# EAGLE design target (EAGLE 7.0.0)
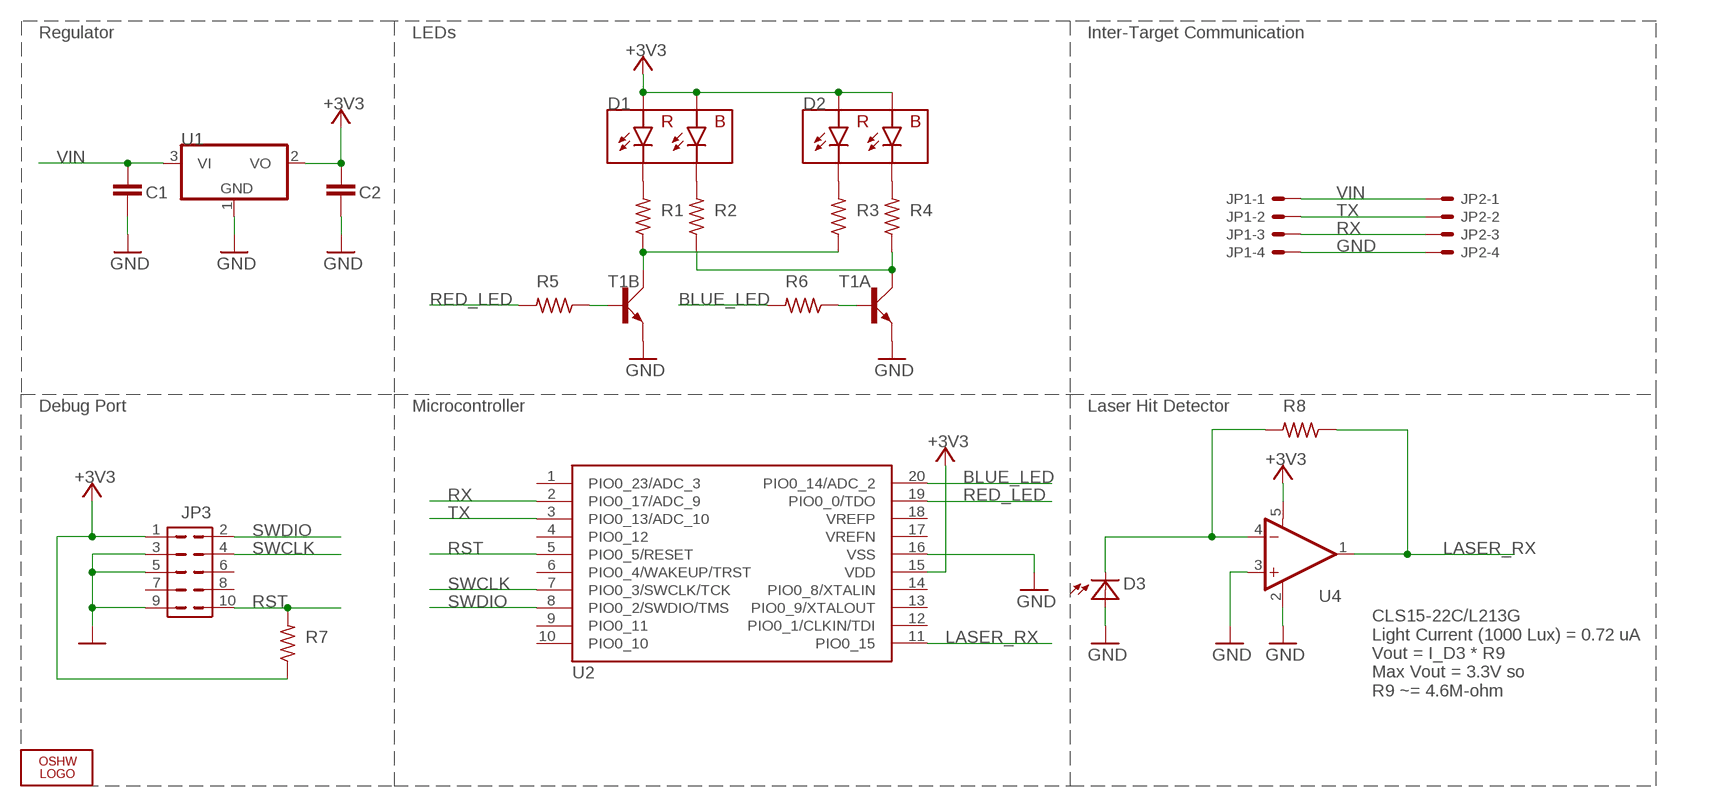
[diagram p0: schematic, sheet 1]

## Parts
C1  C1608X5R1C106M080AB  CAP0603-CAP  [0603-CAP]
C2  C1608X5R1C106M080AB  CAP0603-CAP  [0603-CAP]
D1  150141RB73100  LED_RB  [150141RB]
D2  150141RB73100  LED_RB  [150141RB]
D3  638-CLS1522CL213GTR8  CLS15CLS15  [CLS15]
JP1  798-DF134P125V20  53398-04  [53398-04]
JP2  798-DF134P125V20  53398-04  [53398-04]
JP3  FTSH-105-01-L  FTSH-105  [FTSH-105-01-XXX-DV-K]
LOGO2  OSHW_LOGO_FILLX0150-NT  [OSHW_FILLX150_NOTEXT]
R1  71-CRCW060368R0FKEB  R-US_R0603  [R0603]
R2  71-CRCW0603-5.6-E3  R-US_R0603  [R0603]
R3  71-CRCW060368R0FKEB  R-US_R0603  [R0603]
R4  71-CRCW0603-5.6-E3  R-US_R0603  [R0603]
R5  71-CRCW0603220RFKEB  R-US_R0603  [R0603]
R6  71-CRCW0603220RFKEB  R-US_R0603  [R0603]
R7  71-CRCW0603-10K-E3  R-US_R0603  [R0603]
R8  71-CRCW06034M64FKEA  R-US_R0603  [R0603]
T1  771-BC847BS-T/R  BC847BS  [SOT363_PHILIPS]
U1  579-MCP1703T-3002ECB  MCP1703CB  [SOT23]
U2  771-LPC824M201JDH20J  LPC824  [TSSOP20]
U4  579-MCP6291T-E/OT  MCP6291T-E/OT  [SOT23-5]

## Nets
+3V3: C2.1 D1.1 D1.2 D2.1 D2.2 JP3.1 R7.1 U1.2(VO) U2.15(VDD) U4.5(V+)
BLUE_LED: R6.2 U2.20(PIO0_14/ADC_2)
GND: C1.2 C2.2 D3.1(A) D3.2(A) JP1.4 JP2.4 JP3.3 JP3.5 JP3.9 T1.1(A:E) T1.4(B:E) U1.1(GND) U2.16(VSS) U4.2(V-) U4.3(+IN)
LASER_RX: R8.1 U2.11(PIO0_15) U4.1(OUT)
N$1: R2.1 R4.1 T1.6(A:C)
N$2: R1.1 R3.1 T1.3(B:C)
N$3: D1.3 R1.2
N$4: R6.1 T1.2(A:B)
N$5: D3.3(C) D3.4(C) R8.2 U4.4(-IN)
N$6: D2.3 R3.2
N$7: D1.4 R2.2
N$8: D2.4 R4.2
N$11: R5.1 T1.5(B:B)
RED_LED: R5.2 U2.19(PIO0_0/TDO)
RST: JP3.10 R7.2 U2.5(PIO0_5/RESET)
RX: JP1.3 JP2.3 U2.2(PIO0_17/ADC_9)
SWCLK: JP3.4 U2.7(PIO0_3/SWCLK/TCK)
SWDIO: JP3.2 U2.8(PIO0_2/SWDIO/TMS)
TX: JP1.2 JP2.2 U2.3(PIO0_13/ADC_10)
VIN: C1.1 JP1.1 JP2.1 U1.3(VI)
Unconnected: JP3.6 JP3.7 JP3.8 U2.1(PIO0_23/ADC_3) U2.4(PIO0_12) U2.6(PIO0_4/WAKEUP/TRST) U2.9(PIO0_11) U2.10(PIO0_10) U2.12(PIO0_1/CLKIN/TDI) U2.13(PIO0_9/XTALOUT) U2.14(PIO0_8/XTALIN) U2.17(VREFN) U2.18(VREFP)

## Notes on the sheet
- Regulator | LEDs | Inter-Target Communication
- Debug Port | Microcontroller | Laser Hit Detector
- CLS15-22C/L213G
  Light Current (1000 Lux) = 0.72 uA
  Vout = I_D3 * R9
  Max Vout = 3.3V so
  R9 ~= 4.6M-ohm

## Library data of the parts
C1 C2 = SparkFun-Passives:CAP: Capacitor Standard 0603 ceramic capacitor, and 0.1" leaded capacitor.
D1 D2 = torpedo:LED_RB
D3 = torpedo:CLS15
JP1 JP2 = con-molex:53?-04: CONNECTOR wire to board 1.25 mm (.049 inch) pitch header; OC_FARNELL: 1125367; OC_NEWARK: unknown
JP3 = torpedo:FTSH-105
LOGO2 = ohw-logo:OSHW_LOGO_FILL
R1-R8 = rcl:R-US_: RESISTOR, American symbol
T1 = transistor-small-signal:BC847BS: NPN general purpose double transistor Source: http://www.farnell.com/datasheets/2466.pdf
U1 = linear:MCP1703: 250 mA, 16V, Low Quiescent Current LDO Regulator Source: http://ww1.microchip.com/downloads/en/DeviceDoc/22049b.pdf
U2 = torpedo:LPC824
U4 = SparkFun-AnalogIC:MCP6291: Rail to rail OpAmp with 10MHz GBP; PROD_ID: IC-11991

## Board
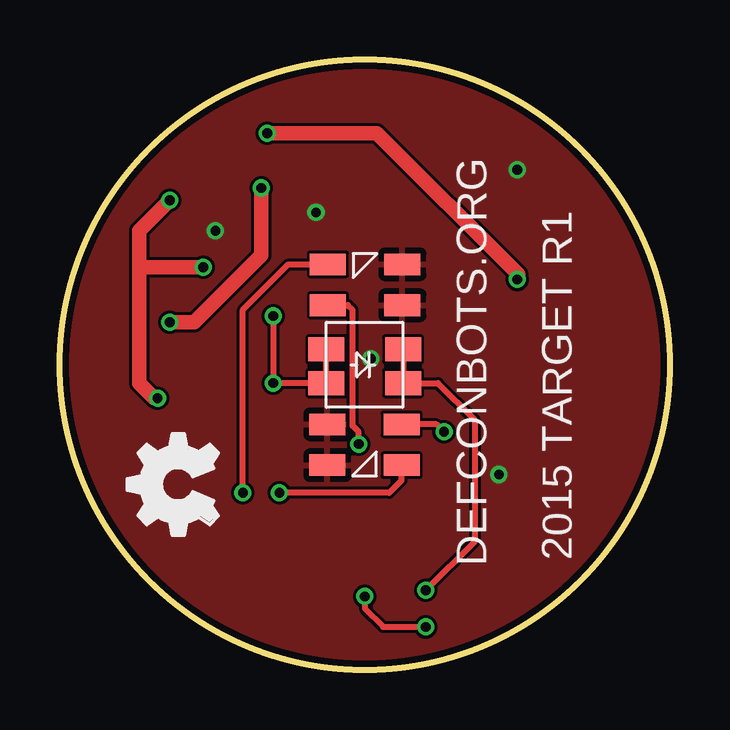
[diagram p1: board, top side]
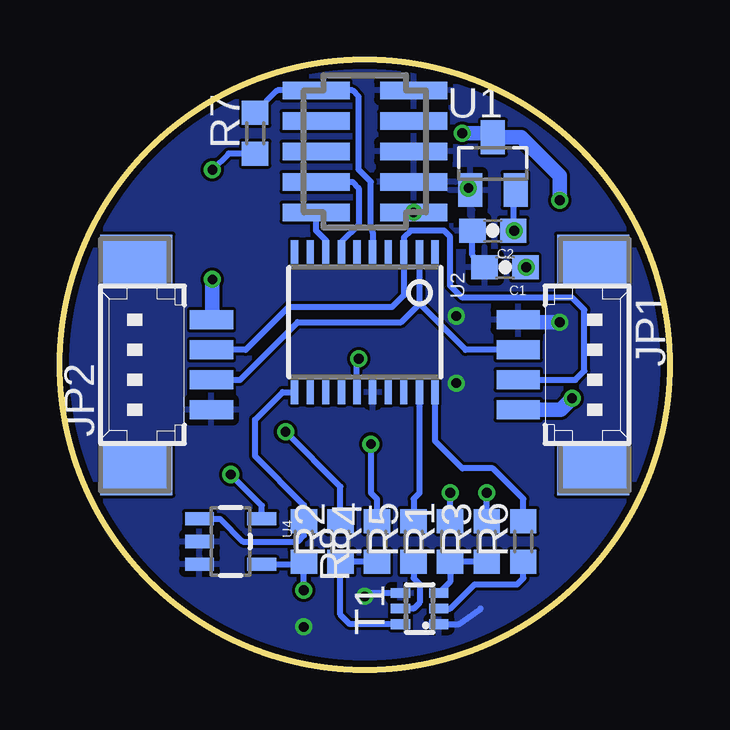
[diagram p2: board, bottom side, seen from below]

Size 25.4 x 25.4 mm. Coordinates in mm from the lower left corner, seen from the top.
Outline: circle at 12.7,12.7 radius 12.7
Copper layers (1*16): Top 0.035mm / dielectric 1.5mm / Bottom 0.035mm
Design rules "dirt_cheap_dirty_boards.v1": minimum track width 5mil, minimum drill 12mil, track to track 5mil, track to pad 5mil, pad to pad 5mil, via to via 5mil, smd to smd 0mil, copper to edge 10mil, drill to drill 10mil, minimum pad ring 10mil, minimum via ring 6mil, stop-mask expansion 2mil, vias tented up to drill 25mil, thermal gap 10mil

### Footprints (pad centres in the part's own frame; a part is rotated, then mirrored left to right if it is on the bottom)
0603-CAP = smd 1.1 x 1: 1 -0.85,0; 2 0.85,0
150141RB = smd 1.5 x 0.9: 1 3.85,2.15; 2 3.85,0.45; 3 0.75,2.15; 4 0.75,0.45
CLS15 = smd 1.5 x 1: 1 0,0; 2 0,1.4; 3 3.2,1.4; 4 3.2,0
53398-04 = smd 0.8 x 1.8: 1 1.875,-2.5; 2 0.625,-2.5; 3 -0.625,-2.5; 4 -1.875,-2.5 | smd 2.1 x 3: S1 4.375,0.625; S2 -4.375,0.625
FTSH-105-01-XXX-DV-K = smd 0.737 x 2.794: 1 -2.54,-2.032; 2 -2.54,2.032; 3 -1.27,-2.032; 4 -1.27,2.032; 5 0,-2.032; 6 0,2.032; 7 1.27,-2.032; 8 1.27,2.032; 9 2.54,-2.032; 10 2.54,2.032
R0603 = smd 1 x 1.1: 1 -0.85,0; 2 0.85,0
SOT363_PHILIPS = smd 0.4 x 0.8: 1 -0.65,-0.8; 2 0,-0.8; 3 0.65,-0.8; 4 0.65,0.8; 5 0,0.8; 6 -0.65,0.8
SOT23 = smd 1 x 1.4: 1 -0.95,-1.1; 2 0.95,-1.1; 3 0,1.1
TSSOP20 = smd 0.305 x 0.991: 1 -2.925,-2.918; 2 -2.275,-2.918; 3 -1.625,-2.918; 4 -0.975,-2.918; 5 -0.325,-2.918; 6 0.325,-2.918; 7 0.975,-2.918; 8 1.625,-2.918; 9 2.275,-2.918; 10 2.925,-2.918; 11 2.925,2.918; 12 2.275,2.918; 13 1.625,2.918; 14 0.975,2.918; 15 0.325,2.918; 16 -0.325,2.918; 17 -0.975,2.918; 18 -1.625,2.918; 19 -2.275,2.918; 20 -2.925,2.918
SOT23-5 = smd 0.55 x 1.2: 1 -0.95,-1.3; 2 0,-1.3; 3 0.95,-1.3; 4 0.95,1.3; 5 -0.95,1.3

### Placement (x,y rotation side)
C1  6.86,16.76 180 bottom
C2  7.37,18.29 180 bottom
D1  14.99,10.67 180 top
D2  10.41,14.73 0 top
D3  11.1,11.94 0 top
JP1  3.81,12.7 270 bottom
JP2  21.59,12.7 90 bottom
JP3  12.7,21.59 90 bottom
LOGO2  6.6,5.59 90 top
R1  9.14,5.33 90 bottom
R2  13.72,5.33 90 bottom
R3  7.62,5.33 90 bottom
R4  12.19,5.33 90 bottom
R5  10.67,5.33 90 bottom
R6  6.1,5.33 90 bottom
R7  17.27,22.35 90 bottom
R8  15.24,5.33 270 bottom
T1  10.41,2.54 90 bottom
U1  7.37,21.08 0 bottom
U2  12.7,14.48 180 bottom
U4  18.29,5.33 270 bottom

### Tracks (layer width: path | path; a pad name or v marks a point on that pad's centre or on a via)
+3V3  (via drill 0.41)
  Bottom 0.254: U1.2 6.52,19.88 C2.1 arc-180 v6.48,18.29 | R7.1 18.38,21.5 v19.05,20.83 | U2.15 13.03,12.88 v12.95,12.95 | U4.5 16.99,6.83 v18.29,8.13
  other vias: 10.67,19.05
  pour Top: 0,0 0,25.4 25.4,25.4 25.4,0
BLUE_LED
  Bottom 0.254: U2.20 9.78,9.52 8.64,8.38 7.37,8.38 6.1,7.11 R6.2
GND  (via drill 0.41)
  Top 0.254: D3.2 D3.1 v8.89,11.94 v8.89,14.73 | v12.7,3.05 12.7,2.54 13.46,1.78 v15.24,1.78
  Top 0.61: v8.38,20.07 8.38,17.27 5.59,14.48 v4.57,14.48
  Bottom 0.254: U1.1 8.22,19.88 | T1.1 8.78,1.89 7.87,2.54 | T1.4 12.59,3.19 v12.7,3.05 | 6.1,14.48 JP1.4 | C1.2 8.22,17.27 C2.2
  Bottom 0.61: 6.1,14.48 v4.57,14.48
  pour Bottom: 12.62,-5.23 -5.34,12.73 12.62,30.69 30.58,12.73
LASER_RX
  Bottom 0.254: U4.1 18.73,6.28 17.78,5.33 15.49,5.33 15.24,5.59 R8.1 15.24,6.86 17.27,8.89 17.27,10.41 16.13,11.56 U2.11
N$1
  Bottom 0.254: R4.1 R2.1 13.72,2.29 13.32,1.89 T1.6
N$2
  Bottom 0.254: R3.1 R1.1 9.14,3.66 T1.3
N$3  (via drill 0.41)
  Top 0.254: D1.3 14.22,8.51 14.22,7.87 13.72,7.37 v9.14,7.37
  Bottom 0.254: R1.2 v9.14,7.37
N$4
  Bottom 0.254: T1.2 9.14,2.54 8.13,3.56 6.35,3.56 6.1,3.81 R6.1
N$5  (via drill 0.41)
  Top 0.254: D3.3 D3.4 15.75,11.94 17.27,10.41 17.27,5.33 v15.24,3.3
  Bottom 0.254: U4.4 15.34,4.38 R8.2 v15.24,3.3
N$6  (via drill 0.41)
  Top 0.254: v7.62,7.37 7.62,14.99 9.52,16.88 D2.3
  Bottom 0.254: R3.2 v7.62,7.37
N$7  (via drill 0.41)
  Top 0.254: v16,9.91 15.69,10.22 D1.4
  Bottom 0.254: R2.2 13.72,7.62 v16,9.91
N$8  (via drill 0.41)
  Top 0.254: D2.4 12,15.18 12.19,14.99 12.19,10.16 12.45,9.91 v12.45,9.4
  Bottom 0.254: v12.45,9.4 12.45,7.37 12.19,7.11 R4.2
N$11
  Bottom 0.254: R5.1 10.67,3.81 10.41,3.56 10.41,2.79 10.67,2.54 T1.5
RED_LED
  Bottom 0.254: U2.19 10.43,7.36 10.67,7.11 R5.2
RST
  Bottom 0.254: R7.2 16.34,24.13 JP3.10 13.21,24.13 12.95,23.88 12.95,20.83 12.45,20.32 12.45,18.41 12.38,18.22 U2.5
RX
  Bottom 0.254: JP1.3 8.5,13.32 10.41,15.24 | 10.41,15.24 10.41,17.39 U2.2 | JP2.3 17.9,12.07 15.49,14.48 11.18,14.48 10.41,15.24
SWCLK
  Bottom 0.254: JP3.4 13.21,20.32 12.95,20.07 12.95,18.54 13.68,17.82 U2.7
SWDIO
  Bottom 0.254: U2.8 14.32,17.88 14.73,18.29 JP3.2
TX
  Bottom 0.254: JP1.2 3.93,12.07 3.56,12.45 3.56,14.99 4.06,15.49 8.64,15.49 9.14,16 9.14,18.03 9.4,18.29 10.79,18.29 11.07,18.01 U2.3 11.07,15.6 11.57,15.1 15.88,15.1 17.66,13.32 JP2.2
VIN  (via drill 0.41)
  Top 0.254: v4.06,11.3 3.94,11.3 | 19.09,16.3 v19.05,16.26
  Top 0.61: 3.94,11.3 3.3,11.94 3.3,16.76 | 3.3,16.76 3.3,18.29 v4.57,19.56 | v8.64,22.35 13.21,22.35 19.09,16.47 19.09,16.3 | v5.97,16.76 3.3,16.76
  Bottom 0.254: 7.37,22.35 U1.3 | 19.05,14.73 JP2.1 19.05,14.62 | C1.1 v5.97,16.76
  Bottom 0.61: JP1.1 4.54,10.82 v4.06,11.3 | v4.57,19.56 4.57,20.57 6.18,22.18 U1.3 | v8.64,22.35 7.37,22.35 | v19.05,16.26 19.05,14.62

### Text on the board
tPlace: 2015 TARGET R1 | DEFCONBOTS.ORG